# Altium schematic sheet Batt_Op_Amp.SchDoc
size C
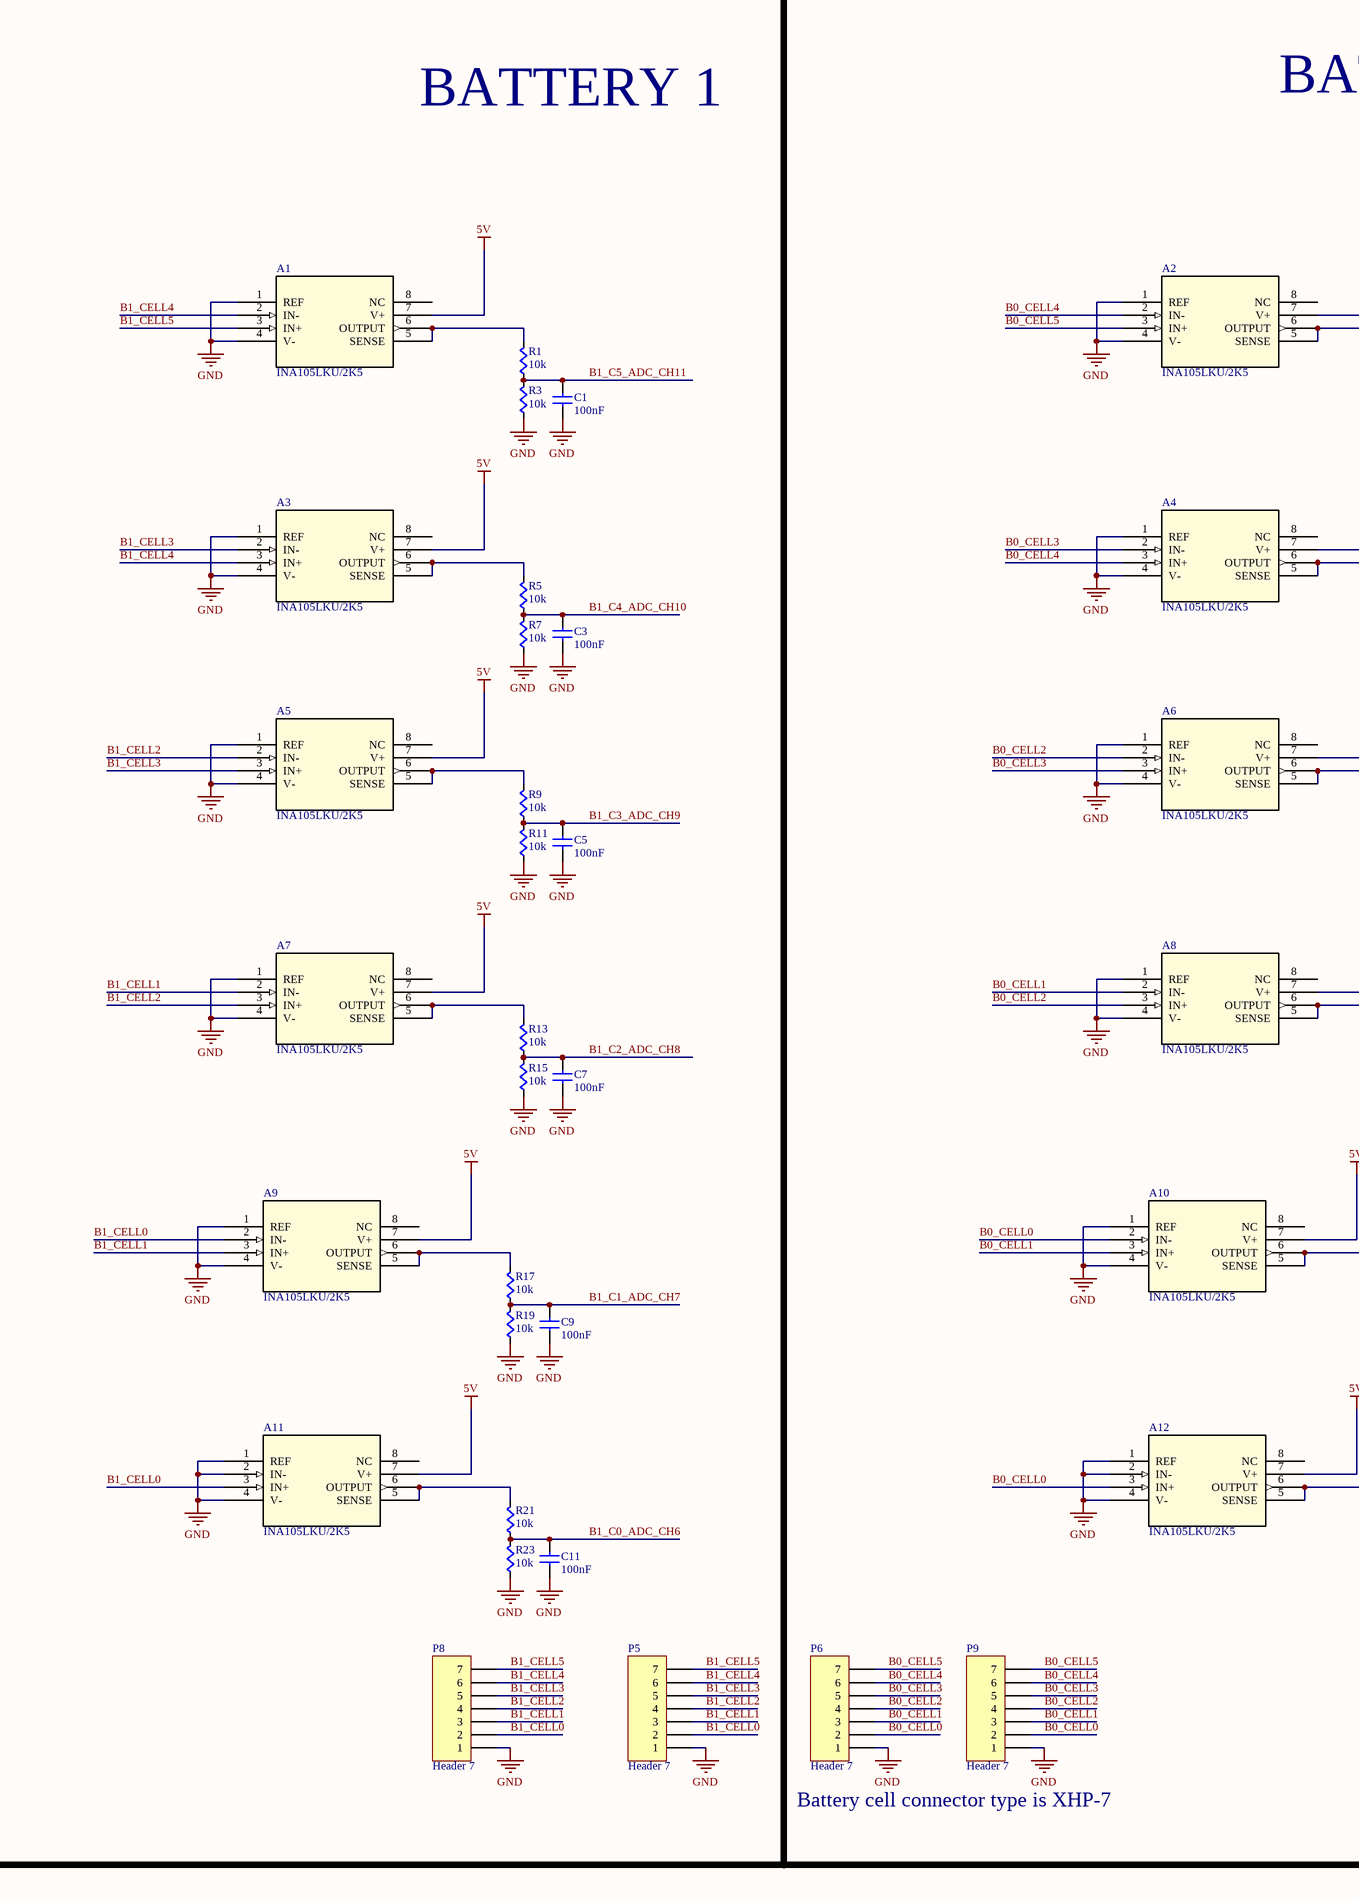
[diagram p0: Batt_Op_Amp.SchDoc, left]
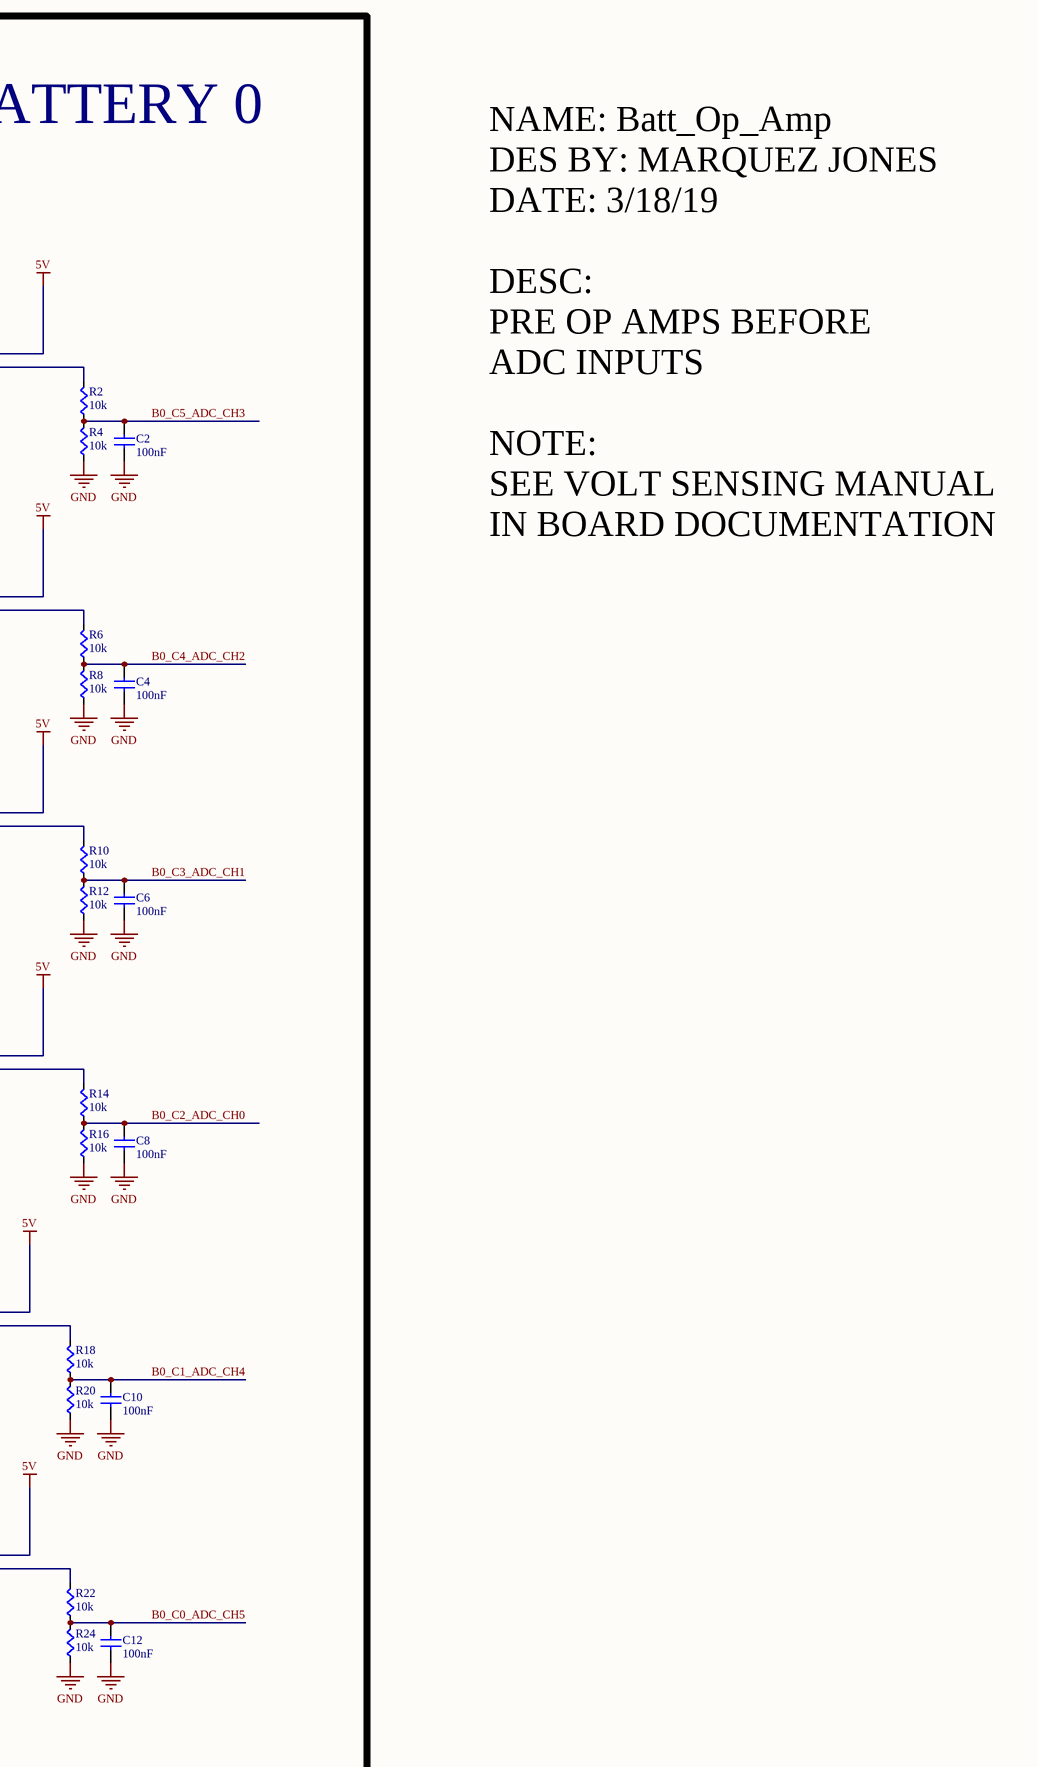
[diagram p1: Batt_Op_Amp.SchDoc, right]

## Parts
A1  INA105LKU/2K5  [SOIC-8N]
A2  INA105LKU/2K5  [SOIC-8N]
A3  INA105LKU/2K5  [SOIC-8N]
A4  INA105LKU/2K5  [SOIC-8N]
A5  INA105LKU/2K5  [SOIC-8N]
A6  INA105LKU/2K5  [SOIC-8N]
A7  INA105LKU/2K5  [SOIC-8N]
A8  INA105LKU/2K5  [SOIC-8N]
A9  INA105LKU/2K5  [SOIC-8N]
A10  INA105LKU/2K5  [SOIC-8N]
A11  INA105LKU/2K5  [SOIC-8N]
A12  INA105LKU/2K5  [SOIC-8N]
C1  value 100nF  [CAPC0603]  (hidden comment: Cap)
C2  value 100nF  [CAPC0603]  (hidden comment: Cap)
C3  value 100nF  [CAPC0603]  (hidden comment: Cap)
C4  value 100nF  [CAPC0603]  (hidden comment: Cap)
C5  value 100nF  [CAPC0603]  (hidden comment: Cap)
C6  value 100nF  [CAPC0603]  (hidden comment: Cap)
C7  value 100nF  [CAPC0603]  (hidden comment: Cap)
C8  value 100nF  [CAPC0603]  (hidden comment: Cap)
C9  value 100nF  [CAPC0603]  (hidden comment: Cap)
C10  value 100nF  [CAPC0603]  (hidden comment: Cap)
C11  value 100nF  [CAPC0603]  (hidden comment: Cap)
C12  value 100nF  [CAPC0603]  (hidden comment: Cap)
P5  Header 7  [HDR1X7]
P6  Header 7  [HDR1X7]
P8  Header 7  [HDR1X7]
P9  Header 7  [HDR1X7]
R1  value 10k  [RES0603]  (hidden comment: Res)
R2  value 10k  [RES0603]  (hidden comment: Res)
R3  value 10k  [RES0603]  (hidden comment: Res)
R4  value 10k  [RES0603]  (hidden comment: Res)
R5  value 10k  [RES0603]  (hidden comment: Res)
R6  value 10k  [RES0603]  (hidden comment: Res)
R7  value 10k  [RES0603]  (hidden comment: Res)
R8  value 10k  [RES0603]  (hidden comment: Res)
R9  value 10k  [RES0603]  (hidden comment: Res)
R10  value 10k  [RES0603]  (hidden comment: Res)
R11  value 10k  [RES0603]  (hidden comment: Res)
R12  value 10k  [RES0603]  (hidden comment: Res)
R13  value 10k  [RES0603]  (hidden comment: Res)
R14  value 10k  [RES0603]  (hidden comment: Res)
R15  value 10k  [RES0603]  (hidden comment: Res)
R16  value 10k  [RES0603]  (hidden comment: Res)
R17  value 10k  [RES0603]  (hidden comment: Res)
R18  value 10k  [RES0603]  (hidden comment: Res)
R19  value 10k  [RES0603]  (hidden comment: Res)
R20  value 10k  [RES0603]  (hidden comment: Res)
R21  value 10k  [RES0603]  (hidden comment: Res)
R22  value 10k  [RES0603]  (hidden comment: Res)
R23  value 10k  [RES0603]  (hidden comment: Res)
R24  value 10k  [RES0603]  (hidden comment: Res)

## Blocks framed on the sheet
BATTERY 1: A1 A3 A5 A7 A9 A11 C1 C3 C5 C7 C9 C11 P5 P8 R1 R3 R5 R7 R9 R11 R13 R15 R17 R19 R21 R23
BATTERY 0: A2 A4 A6 A8 A10 A12 C2 C4 C6 C8 C10 C12 P6 P9 R2 R4 R6 R8 R10 R12 R14 R16 R18 R20 R22 R24

## Nets
5V: A1.7(V+) A2.7(V+) A3.7(V+) A4.7(V+) A5.7(V+) A6.7(V+) A7.7(V+) A8.7(V+) A9.7(V+) A10.7(V+) A11.7(V+) A12.7(V+)
GND: A1.1(REF) A1.4(V-) A2.1(REF) A2.4(V-) A3.1(REF) A3.4(V-) A4.1(REF) A4.4(V-) A5.1(REF) A5.4(V-) A6.1(REF) A6.4(V-) A7.1(REF) A7.4(V-) A8.1(REF) A8.4(V-) A9.1(REF) A9.4(V-) A10.1(REF) A10.4(V-) A11.1(REF) A11.2(IN-) A11.4(V-) A12.1(REF) A12.2(IN-) A12.4(V-) C1.2(B) C2.2(B) C3.2(B) C4.2(B) C5.2(B) C6.2(B) C7.2(B) C8.2(B) C9.2(B) C10.2(B) C11.2(B) C12.2(B) P5.1 P6.1 P8.1 P9.1 R3.2(B) R4.2(B) R7.2(B) R8.2(B) R11.2(B) R12.2(B) R15.2(B) R16.2(B) R19.2(B) R20.2(B) R23.2(B) R24.2(B)
B0_C0_ADC_CH5: C12.1(A) R22.2(B) R24.1(A)
B0_C1_ADC_CH4: C10.1(A) R18.2(B) R20.1(A)
B0_C2_ADC_CH0: C8.1(A) R14.2(B) R16.1(A)
B0_C3_ADC_CH1: C6.1(A) R10.2(B) R12.1(A)
B0_C4_ADC_CH2: C4.1(A) R6.2(B) R8.1(A)
B0_C5_ADC_CH3: C2.1(A) R2.2(B) R4.1(A)
B0_CELL0: A10.2(IN-) A12.3(IN+) P6.2 P9.2
B0_CELL1: A8.2(IN-) A10.3(IN+) P6.3 P9.3
B0_CELL2: A6.2(IN-) A8.3(IN+) P6.4 P9.4
B0_CELL3: A4.2(IN-) A6.3(IN+) P6.5 P9.5
B0_CELL4: A2.2(IN-) A4.3(IN+) P6.6 P9.6
B0_CELL5: A2.3(IN+) P6.7 P9.7
B1_C0_ADC_CH6: C11.1(A) R21.2(B) R23.1(A)
B1_C1_ADC_CH7: C9.1(A) R17.2(B) R19.1(A)
B1_C2_ADC_CH8: C7.1(A) R13.2(B) R15.1(A)
B1_C3_ADC_CH9: C5.1(A) R9.2(B) R11.1(A)
B1_C4_ADC_CH10: C3.1(A) R5.2(B) R7.1(A)
B1_C5_ADC_CH11: C1.1(A) R1.2(B) R3.1(A)
B1_CELL0: A9.2(IN-) A11.3(IN+) P5.2 P8.2
B1_CELL1: A7.2(IN-) A9.3(IN+) P5.3 P8.3
B1_CELL2: A5.2(IN-) A7.3(IN+) P5.4 P8.4
B1_CELL3: A3.2(IN-) A5.3(IN+) P5.5 P8.5
B1_CELL4: A1.2(IN-) A3.3(IN+) P5.6 P8.6
B1_CELL5: A1.3(IN+) P5.7 P8.7
NetA1_5: A1.5(SENSE) A1.6(OUTPUT) R1.1(A)
NetA2_5: A2.5(SENSE) A2.6(OUTPUT) R2.1(A)
NetA3_5: A3.5(SENSE) A3.6(OUTPUT) R5.1(A)
NetA4_5: A4.5(SENSE) A4.6(OUTPUT) R6.1(A)
NetA5_5: A5.5(SENSE) A5.6(OUTPUT) R9.1(A)
NetA6_5: A6.5(SENSE) A6.6(OUTPUT) R10.1(A)
NetA7_5: A7.5(SENSE) A7.6(OUTPUT) R13.1(A)
NetA8_5: A8.5(SENSE) A8.6(OUTPUT) R14.1(A)
NetA9_5: A9.5(SENSE) A9.6(OUTPUT) R17.1(A)
NetA10_5: A10.5(SENSE) A10.6(OUTPUT) R18.1(A)
NetA11_5: A11.5(SENSE) A11.6(OUTPUT) R21.1(A)
NetA12_5: A12.5(SENSE) A12.6(OUTPUT) R22.1(A)

Not connected (* = marked no-connect by the designer): A1 8(NC); A2 8(NC); A3 8(NC); A4 8(NC); A5 8(NC); A6 8(NC); A7 8(NC); A8 8(NC); A9 8(NC); A10 8(NC); A11 8(NC); A12 8(NC)

## Notes on the sheet
- NAME: Batt_Op_Amp
  DES BY: MARQUEZ JONES
  DATE: 3/18/19
  DESC:
  PRE OP AMPS BEFORE
  ADC INPUTS
  NOTE:
  SEE VOLT SENSING MANUAL
  IN BOARD DOCUMENTATION
- Battery cell connector type is XHP-7

## Library data of the parts
P5 P6 P8 P9 = Header 7: Header, 7-Pin; LatestRevisionDate: 17-Jul-2002; LatestRevisionNote: Re-released for DXP Platform.; Publisher: Altium Limited
C1-C12 = Cap: Supplier 1: Digi-Key; Supplier Part Number 1: 1276-1000-1-ND
R1-R24 = Res: Supplier 1: Digi-Key; Supplier Part Number 1: RMCF0603JT10K0CT-ND